# Altium schematic sheet PLD_SunSref-Interface.SchDoc: SunS Ref. Interface
size A4; SheetTotal: 32
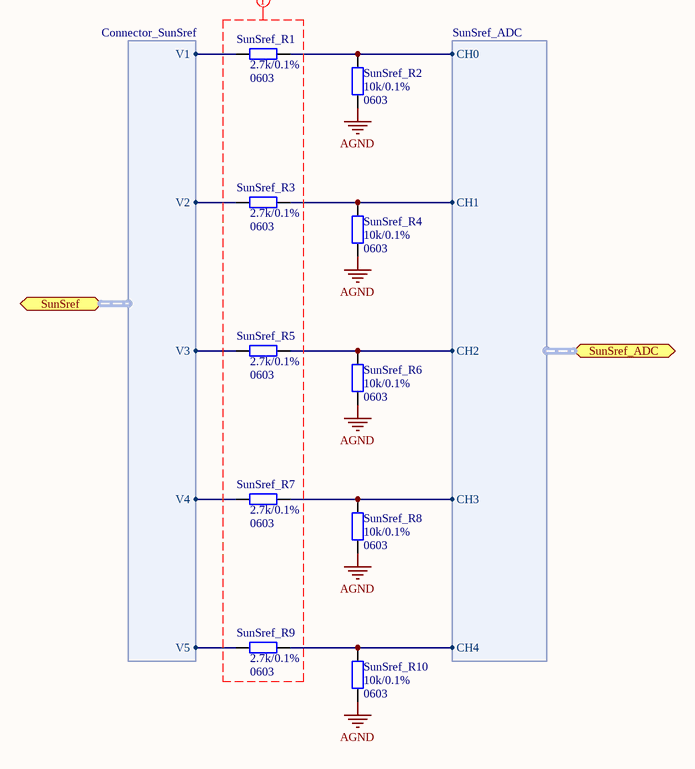
[diagram p0: PLD_SunSref-Interface.SchDoc]

## Parts
SunSref_R1  Package: 0603  [SMD_Resistor_0603]  (hidden comment: 2.7k/0.1%)
SunSref_R2  Package: 0603  [SMD_Resistor_0603]  (hidden comment: 10k/0.1%)
SunSref_R3  Package: 0603  [SMD_Resistor_0603]  (hidden comment: 2.7k/0.1%)
SunSref_R4  Package: 0603  [SMD_Resistor_0603]  (hidden comment: 10k/0.1%)
SunSref_R5  Package: 0603  [SMD_Resistor_0603]  (hidden comment: 2.7k/0.1%)
SunSref_R6  Package: 0603  [SMD_Resistor_0603]  (hidden comment: 10k/0.1%)
SunSref_R7  Package: 0603  [SMD_Resistor_0603]  (hidden comment: 2.7k/0.1%)
SunSref_R8  Package: 0603  [SMD_Resistor_0603]  (hidden comment: 10k/0.1%)
SunSref_R9  Package: 0603  [SMD_Resistor_0603]  (hidden comment: 2.7k/0.1%)
SunSref_R10  Package: 0603  [SMD_Resistor_0603]  (hidden comment: 10k/0.1%)

## Ports
SunSref (harness Connector_SunSref), SunSref_ADC (harness SunSref_ADC)

## Harnesses
Connector_SunSref: V1, V2, V3, V4, V5
SunSref_ADC: CH0, CH1, CH2, CH3, CH4

## Nets
AGND: SunSref_R2.1 SunSref_R4.1 SunSref_R6.1 SunSref_R8.1 SunSref_R10.1
NetSunSref_R1_1: SunSref_R1.1 ; port SunSref.V1
NetSunSref_R1_2: SunSref_R1.2 SunSref_R2.2 ; port SunSref_ADC.CH0
NetSunSref_R3_1: SunSref_R3.1 ; port SunSref.V2
NetSunSref_R3_2: SunSref_R3.2 SunSref_R4.2 ; port SunSref_ADC.CH1
NetSunSref_R5_1: SunSref_R5.1 ; port SunSref.V3
NetSunSref_R5_2: SunSref_R5.2 SunSref_R6.2 ; port SunSref_ADC.CH2
NetSunSref_R7_1: SunSref_R7.1 ; port SunSref.V4
NetSunSref_R7_2: SunSref_R7.2 SunSref_R8.2 ; port SunSref_ADC.CH3
NetSunSref_R9_1: SunSref_R9.1 ; port SunSref.V5
NetSunSref_R9_2: SunSref_R9.2 SunSref_R10.2 ; port SunSref_ADC.CH4

## Layout directives
net class SunS-ref: (no net found under the mark)

## Notes on the sheet
- Title:
- Project:
- Author:
- Model:
- Document Number:
- Checked by:
- Rev:
- Date:
- Approved by:
- Sheet:
- of
- File name:

## Library data of the parts
SunSref_R1-SunSref_R10 = Res
  SunSref_R1 SunSref_R3 SunSref_R5 SunSref_R7 SunSref_R9: Value: 2.7k/0.1%
  SunSref_R2 SunSref_R4 SunSref_R6 SunSref_R8 SunSref_R10: Value: 10k/0.1%